# Altium schematic sheet powerB.SchDoc
size A4
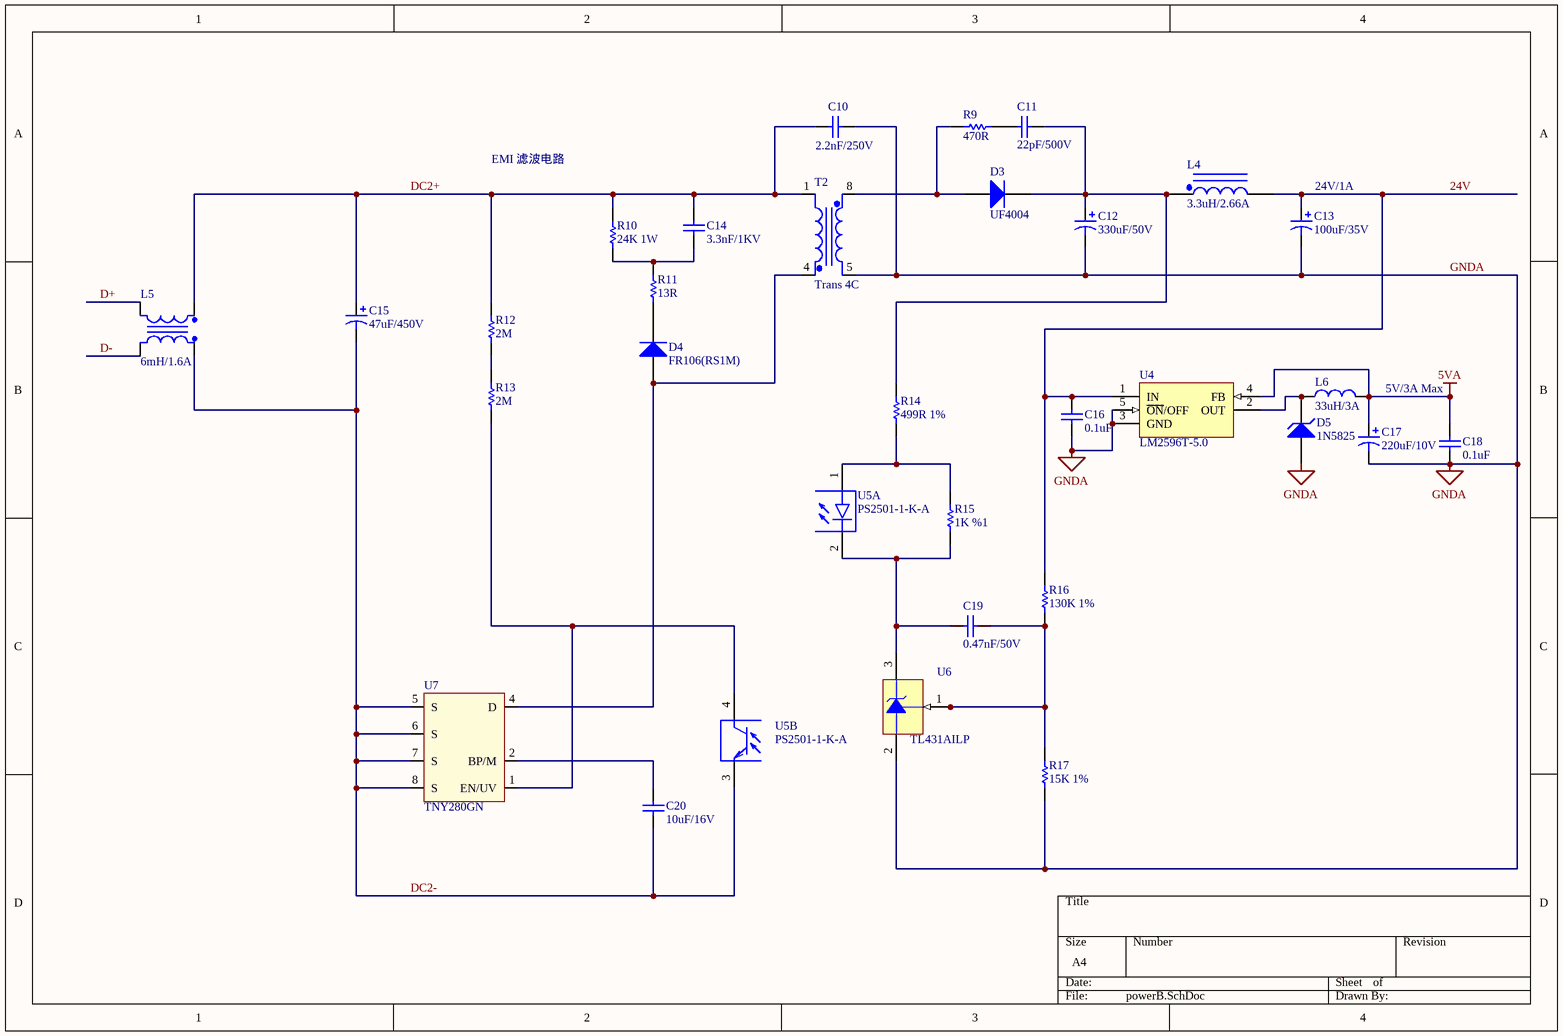
[diagram p0: powerB.SchDoc]

## Parts
C10  2.2nF/250V  [CAPRD5-9x3B]
C11  22pF/500V  [CAPC3216M]
C12  330uF/50V  [CAPPR5-10x16]
C13  100uF/35V  [CAPPR2.5-6.3x11.5]
C14  3.3nF/1KV  [CAPRD5-4.5x3A]
C15  47uF/450V  [CAPPR7.5-18x25A]
C16  0.1uF  [CAPC3216M]
C17  220uF/10V  [CAPPR2.5-6.3x11.5]
C18  0.1uF  [CAPC3216M]
C19  0.47nF/50V  [CAPC3216M]
C20  10uF/16V  [CAPC3216M]
D3  UF4004  [SMA]
D4  FR106(RS1M)  [SMA]
D5  1N5825  [SMB]
L4  3.3uH/2.66A  [L0810]
L5  6mH/1.6A  [TRF_4A]
L6  33uH/3A  [L0810]
R9  470R  [RESC3216M]
R10  24K 1W  [RES13.55-11.5X4.2]
R11  13R  [RESC3216M]
R12  2M  [RESC3216M]
R13  2M  [RESC3216M]
R14  499R 1%  [RESC3216M]
R15  1K %1  [RESC3216M]
R16  130K 1%  [RESC3216M]
R17  15K 1%  [RESC3216M]
T2  Trans 4C  [EE22W(2+2)]
U4  LM2596T-5.0  [TO-220-5]
U5  PS2501-1-K-A  [SOP-4]  (parts A,B of 2)
U6  TL431AILP  [TO-92AA]
U7  TNY280GN  [SMD-8C]

## Nets
5VA: C17.1 C18.2 L6.2 U4.4(FB)
GNDA: C10.2 C12.2 C13.2 C16.2 C17.2 C18.1 D5.1(A) R17.1 T2.5(Sec-) U4.3(GND) U4.5(~{ON}/OFF) U6.2(A)
24V: C13.1 C16.1 L4.2 R16.2 U4.1(IN)
D+: L5.4(Sec-)
D-: L5.3(Pri-)
DC2+: C10.1 C14.1 C15.1 L5.2(Sec+) R10.1 R12.2 T2.1(Pri+)
DC2-: C15.2 C20.2 L5.1(Pri+) U5.3(E) U7.5(S) U7.6(S) U7.7(S) U7.8(S)
NetC11_1: C11.1 C12.1 D3.2(K) L4.1 R14.2
NetC11_2: C11.2 R9.1
NetC14_2: C14.2 R10.2 R11.1
NetC19_1: C19.1 R16.1 R17.2 U6.1(REF)
NetC19_2: C19.2 R15.1 U5.2(-) U6.3(K)
NetC20_1: C20.1 U7.2(BP/M)
NetD3_1: D3.1(A) R9.2 T2.8(Sec+)
NetD4_1: D4.1(A) T2.4(Pri-) U7.4(D)
NetD4_2: D4.2(K) R11.2
NetD5_2: D5.2(K) L6.1 U4.2(OUT)
NetR12_1: R12.1 R13.1
NetR13_2: R13.2 U5.4(C) U7.1(EN/UV)
NetR14_1: R14.1 R15.2 U5.1(+)

## Notes on the sheet
- EMI 滤波电路
- (near C13) 24V/1A
- 5V/3A Max

## Library data of the parts
C10 C11 C14 C19 C20 = Cap: Capacitor; Value: 100pF; Published: 8-Jun-2000; LatestRevisionDate: 17-Jul-2002; LatestRevisionNote: Re-released for DXP Platform.; PackageReference: RAD-0.3; Publisher: Altium Limited
C12 C13 C15 C17 = Cap Pol1: Polarized Capacitor (Radial); Value: 100pF; Published: 8-Jun-2000; LatestRevisionDate: 17-Jul-2002; LatestRevisionNote: Re-released for DXP Platform.; PackageReference: RB7.6-15; Publisher: Altium Limited
C16 C18 = Cap: Capacitor; Value: 1nF; Published: 8-Jun-2000; LatestRevisionDate: 17-Jul-2002; LatestRevisionNote: Re-released for DXP Platform.; PackageReference: RAD-0.3; Publisher: Altium Limited
D3 D4 = Diode 1N4148: High Conductance Fast Diode; Published: 8-Jun-2000; LatestRevisionDate: 17-Jul-2002; LatestRevisionNote: Re-released for DXP Platform.; DatasheetVersion: 1997; PackageReference: DO-35; Publisher: Altium Limited; Code_JEDEC: DO-204-AH; ComponentLink1Description: Manufacturer Link; ComponentLink1URL: http://www.fairchildsemi.com/; ComponentLink2Description: Datasheet; ComponentLink2URL: http://www.fairchildsemi.com/ds/1N%2F1N4148.pdf
D5 = D Zener: Zener Diode; Published: 8-Jun-2000; LatestRevisionDate: 17-Jul-2002; LatestRevisionNote: Re-released for DXP Platform.; PackageReference: DIODE-0.7; Publisher: Altium Limited; PackageDescription: Diode, Thru-Hole; 2 Leads; 0.7 in Pin Spacing
L4 = Inductor Iron Dot: Magnetic-Core Inductor with Winding Polarity Marking; Value: 10mH; Published: 24-Mar-1999; LatestRevisionDate: 17-Jul-2002; LatestRevisionNote: Re-released for DXP Platform.; PackageReference: DIODE_SMC; Publisher: Altium Limited; PackageDescription: Diode; 2 Leads
L5 = Inductor Iron Dot Inphase: Conjugate stream coil,pitch 7.62mmx8mm(LxW); Published: 8-Jun-2000; LatestRevisionDate: 17-Jul-2002; LatestRevisionNote: Re-released for DXP Platform.; PackageReference: TRF_4; Publisher: Altium Limited
L6 = Inductor: Inductor with Winding No Polarity Marking; Published: 24-Mar-1999; LatestRevisionDate: 17-Jul-2002; LatestRevisionNote: Re-released for DXP Platform.; PackageReference: DIODE_SMC; Publisher: Altium Limited
R9-R14 R16 R17 = Res Semi: Metal film Resistor; Value: 1K; Published: 8-Jun-2000; LatestRevisionDate: 17-Jul-2002; LatestRevisionNote: Re-released for DXP Platform.; PackageReference: AXIAL-0.5; Publisher: Altium Limited
R15 = Res Semi: Metal film Resistor; Published: 8-Jun-2000; LatestRevisionDate: 17-Jul-2002; LatestRevisionNote: Re-released for DXP Platform.; PackageReference: AXIAL-0.5; Publisher: Altium Limited; Value: 1K
T2 = Trans 4C: Transformer; Published: 8-Jun-2000; LatestRevisionDate: 17-Jul-2002; LatestRevisionNote: Re-released for DXP Platform.; PackageReference: TRF_4; Publisher: Altium Limited
U4 = LM2596T-5.0: 5V稳压芯片; Note: Tab is connected to GND; Published: 15-Apr-2002; DatasheetVersion: Dec-1997; PackageReference: TS5B; Publisher: Altium Limited; PackageDescription: D2-PAK; 5 Leads; Body 14.4 (inc. leads) x 10.4 mm (LxW max); ComponentLink1Description: Manufacturer Link; ComponentLink1URL: http://www.national.com/; ComponentLink2Description: Datasheet; ComponentLink2URL: http://www.national.com/ds.cgi/LM/LM2596.pdf; ComponentLink3Description: URL Link1; ComponentLink3URL: http://www.national.com/pf/LM/LM2596.html
U5 = PC817D: Single-Supply Dual Operational Amplifier,10MHz; Published: 28-Feb-2003; LatestRevisionDate: 13-Apr-2006; LatestRevisionNote: IPC-7351 Footprint Added.; DatasheetVersion: Jan-2002, Rev. 7; PackageVersion: rev7, Jan-2002; PackageReference: 751-07; Publisher: Altium Limited; PackageDescription: 8-Pin Plastic Small Outline Integrated Circuit 1.27 mm Pitch; Code_JEDEC: MS-012-AA; Code_IPC: SOIC127P600-8; ComponentLink1Description: Manufacturer Link; ComponentLink1URL: http://www.onsemi.com/; ComponentLink2Description: Datasheet; ComponentLink2URL: http://www.onsemi.com/pub/Collateral/LM358-D.PDF
U6 = TL431CLP: Programmable Precision Reference; Published: 15-Apr-2002; DatasheetVersion: 1999; PackageVersion: 1996; PackageReference: 29-04; Publisher: Altium Limited; PackageDescription: TO, Flat Index; 3 In-Line, Axial Leads; Body Dia. 4.8mm; Leads 0.48 x 0.51 mm (max); ComponentLink1Description: Manufacturer Link; ComponentLink1URL: http://www.onsemi.com/site/products/taxonomy/0,4438,503,00.html; ComponentLink2Description: Datasheet; ComponentLink2URL: http://www.onsemi.com/pub/Collateral/TL431-D.PDF
U7 = TNY279PN